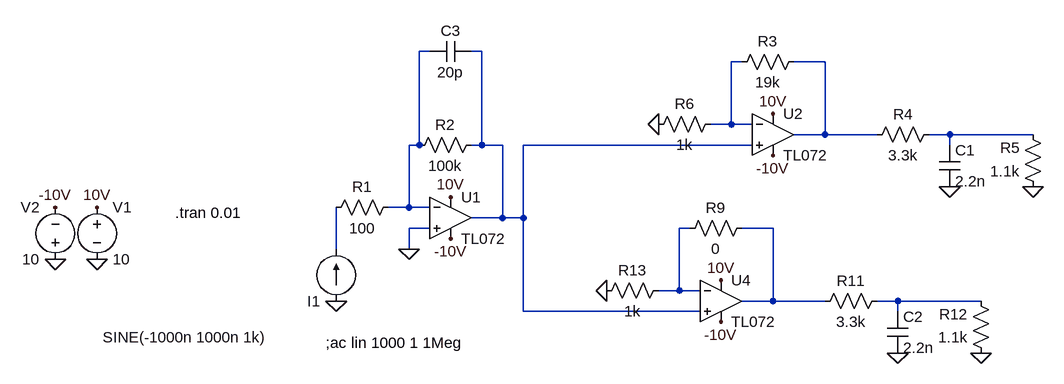
[diagram p0: schematic Model.asc]
Model.asc, the LTspice schematic file:
Version 4
SHEET 1 2156 680
WIRE 64 -96 48 -96
WIRE 144 -96 128 -96
WIRE 544 -80 528 -80
WIRE 672 -80 624 -80
WIRE 528 16 528 -80
WIRE 528 16 496 16
WIRE 560 16 528 16
WIRE 672 32 672 -80
WIRE 672 32 624 32
WIRE 752 32 672 32
WIRE 864 32 832 32
WIRE 992 32 864 32
WIRE 48 48 48 -96
WIRE 48 48 32 48
WIRE 144 48 144 -96
WIRE 144 48 128 48
WIRE 176 48 144 48
WIRE 560 48 208 48
WIRE 864 48 864 32
WIRE 32 144 32 48
WIRE 32 144 0 144
WIRE 64 144 32 144
WIRE 176 160 176 48
WIRE 176 160 128 160
WIRE 208 160 208 48
WIRE 208 160 176 160
WIRE 64 176 32 176
WIRE 464 176 448 176
WIRE 592 176 544 176
WIRE -80 208 -80 144
WIRE 32 208 32 176
WIRE 448 272 448 176
WIRE 448 272 416 272
WIRE 480 272 448 272
WIRE 592 288 592 176
WIRE 592 288 544 288
WIRE 672 288 592 288
WIRE 784 288 752 288
WIRE 912 288 784 288
WIRE 208 304 208 160
WIRE 480 304 208 304
WIRE 784 304 784 288
FLAG 32 208 0
FLAG -80 288 0
FLAG 96 128 10V
FLAG -512 144 -10V
FLAG -448 144 10V
FLAG -512 224 0
FLAG -448 224 0
FLAG 592 0 10V
FLAG 864 112 0
FLAG 992 112 0
FLAG 416 16 0
FLAG 512 256 10V
FLAG 784 368 0
FLAG 912 368 0
FLAG 336 272 0
FLAG 96 192 -10V
FLAG 592 64 -10V
FLAG 512 320 -10V
SYMBOL OpAmps\\TL072 96 96 R0
SYMATTR InstName U1
SYMBOL res 16 128 R90
WINDOW 0 0 56 VBottom 2
WINDOW 3 32 56 VTop 2
SYMATTR InstName R1
SYMATTR Value 100
SYMBOL res 144 32 R90
WINDOW 0 0 56 VBottom 2
WINDOW 3 32 56 VTop 2
SYMATTR InstName R2
SYMATTR Value 100k
SYMBOL current -80 288 R180
WINDOW 3 105 -56 Left 2
WINDOW 39 0 0 Left 0
SYMATTR Value SINE(-1000n 1000n 1k)
SYMATTR InstName I1
SYMBOL voltage -448 128 R0
WINDOW 123 0 0 Left 0
WINDOW 39 0 0 Left 0
SYMATTR InstName V1
SYMATTR Value 10
SYMBOL voltage -512 240 R180
WINDOW 0 24 96 Left 2
WINDOW 3 24 16 Left 2
WINDOW 123 0 0 Left 0
WINDOW 39 0 0 Left 0
SYMATTR InstName V2
SYMATTR Value 10
SYMBOL cap 128 -112 R90
WINDOW 0 0 32 VBottom 2
WINDOW 3 32 32 VTop 2
SYMATTR InstName C3
SYMATTR Value 20p
SYMBOL OpAmps\\TL072 592 -32 R0
SYMATTR InstName U2
SYMBOL res 640 -96 R90
WINDOW 0 0 56 VBottom 2
WINDOW 3 32 56 VTop 2
SYMATTR InstName R3
SYMATTR Value 19k
SYMBOL res 848 16 R90
WINDOW 0 0 56 VBottom 2
WINDOW 3 32 56 VTop 2
SYMATTR InstName R4
SYMATTR Value 3.3k
SYMBOL cap 848 48 R0
SYMATTR InstName C1
SYMATTR Value 2.2n
SYMBOL res 1008 128 R180
WINDOW 0 36 76 Left 2
WINDOW 3 36 40 Left 2
SYMATTR InstName R5
SYMATTR Value 1.1k
SYMBOL res 512 0 R90
WINDOW 0 0 56 VBottom 2
WINDOW 3 32 56 VTop 2
SYMATTR InstName R6
SYMATTR Value 1k
SYMBOL OpAmps\\TL072 512 224 R0
SYMATTR InstName U4
SYMBOL res 560 160 R90
WINDOW 0 0 56 VBottom 2
WINDOW 3 32 56 VTop 2
SYMATTR InstName R9
SYMATTR Value 0
SYMBOL res 768 272 R90
WINDOW 0 0 56 VBottom 2
WINDOW 3 32 56 VTop 2
SYMATTR InstName R11
SYMATTR Value 3.3k
SYMBOL cap 768 304 R0
SYMATTR InstName C2
SYMATTR Value 2.2n
SYMBOL res 928 384 R180
WINDOW 0 36 76 Left 2
WINDOW 3 36 40 Left 2
SYMATTR InstName R12
SYMATTR Value 1.1k
SYMBOL res 432 256 R90
WINDOW 0 0 56 VBottom 2
WINDOW 3 32 56 VTop 2
SYMATTR InstName R13
SYMATTR Value 1k
TEXT -96 352 Left 2 !;ac lin 1000 1 1Meg
TEXT -328 152 Left 2 !.tran 0.01

The netlist it stands for:
* Model.asc
XU1 0 N001 10V -10V N002 TL072  ; pins In+ In- V+ V- OUT
R1 N001 N008 100
R2 N002 N001 100k
I1 0 N008 SINE(-1000n 1000n 1k)
V1 10V 0 10
V2 0 -10V 10
C3 N002 N001 20p
XU2 N002 N003 10V -10V N004 TL072  ; pins In+ In- V+ V- OUT
R3 N004 N003 19k
R4 N005 N004 3.3k
C1 N005 0 2.2n
R5 0 N005 1.1k
R6 N003 0 1k
XU4 N002 N006 10V -10V N007 TL072  ; pins In+ In- V+ V- OUT
R9 N007 N006 0
R11 N009 N007 3.3k
C2 N009 0 2.2n
R12 0 N009 1.1k
R13 N006 0 1k
;ac lin 1000 1 1Meg
.tran 0.01
.backanno
.end